# EAGLE design Arduino_S3v3_R2 (EAGLE 6.2)
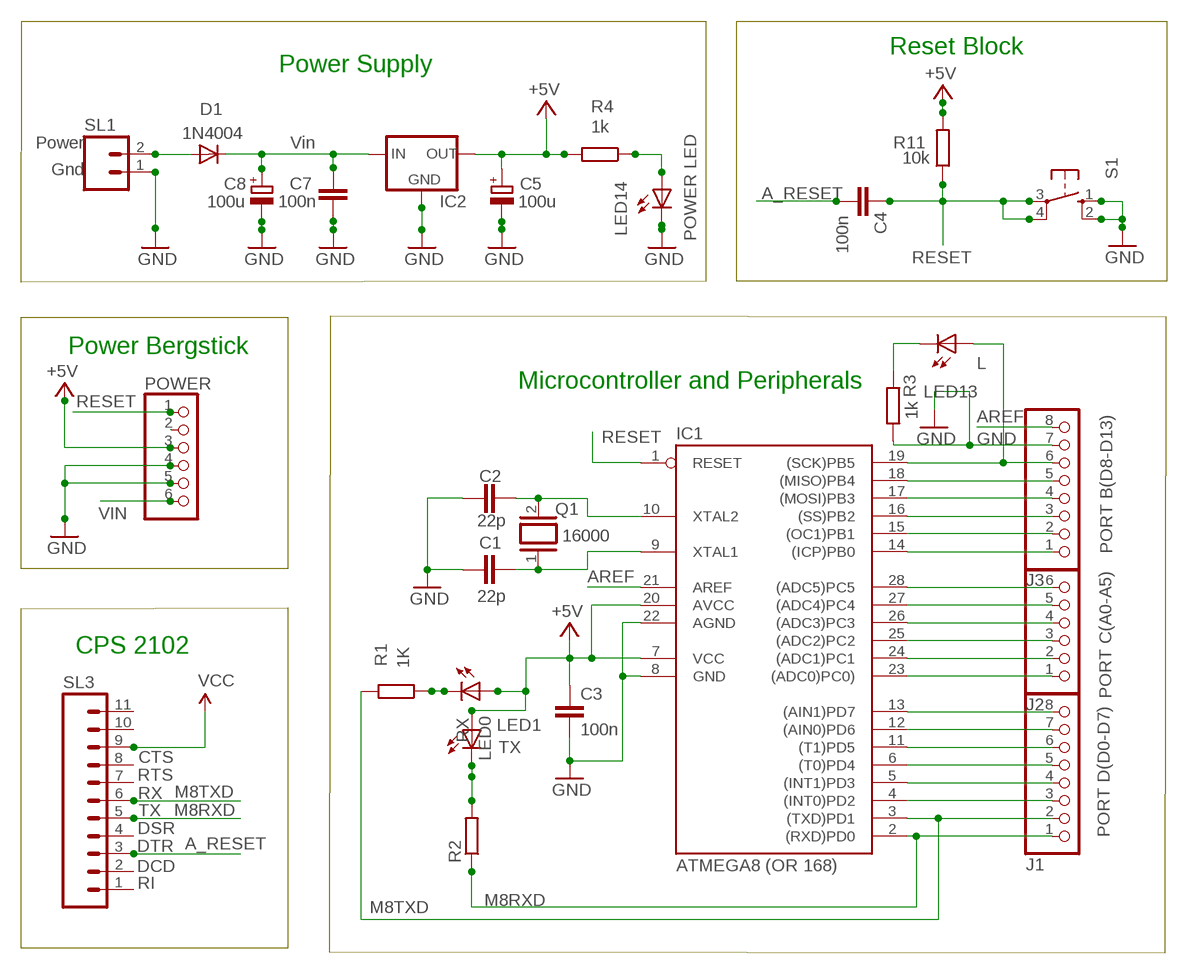
[diagram p0: schematic, sheet 1]

## Parts
C1  22p  C-EU050-025X075  [C050-025X075]
C2  22p  C-EU050-025X075  [C050-025X075]
C3  100n  C-EU050-025X075  [C050-025X075]
C4  100n  C-EU050-025X075  [C050-025X075]
C5  100u  CPOL-EUE3.5-8  [E3,5-8]
C7  100n  C-EU050-025X075  [C050-025X075]
C8  100u  CPOL-EUE3.5-8  [E3,5-8]
D1  1N4004  [DO41-10]
IC1  ATMEGA8 (OR 168)  AT90S4433P  [DIL28-3]
IC2  78XXL  [78XXL]
J1  PORT D(D0-D7)  PINHD-1X8  [1X08]
J2  PORT C(A0-A5)  PINHD-1X6  [1X06]
J3  PORT B(D8-D13)  PINHD-1X8  [1X08]
LED0  RX  LED3MM  [LED3MM]
LED1  TX  LED3MM  [LED3MM]
LED13  L  LED3MM  [LED3MM]
LED14  POWER LED  LED3MM  [LED3MM]
POWER  PINHD-1X6  [1X06]
Q1  16000  XTAL  [Q]
R1  1K  R-EU_0207/10  [0207/10]
R2  R-EU_0207/10  [0207/10]
R3  1k  R-EU_0207/10  [0207/10]
R4  1k  R-EU_0207/10  [0207/10]
R11  10k  R-EU_0207/10  [0207/10]
S1  10-XX  [B3F-10XX]
SL1  M02  [02P]
SL3  M11  [11P]

## Nets
3V3: POWER.2
+5V [power]: C3.1 C5.+ IC1.7(VCC) IC1.20(AVCC) IC2.OUT LED0.A LED1.A POWER.3 R4.2 R11.2
AREF: IC1.21(AREF) J3.8
AUTO_RESET: C4.2 SL3.3
GND: C1.1 C2.1 C3.2 C5.- C7.1 C8.- IC1.8(GND) IC1.22(AGND) IC2.GND J3.7 LED14.K(C) POWER.4 POWER.5 R3.1 S1.1(S) S1.2(S1) SL1.1
M8RXD: IC1.2((RXD)PD0) J1.1 R2.1 SL3.5
M8TXD: IC1.3((TXD)PD1) J1.2 R1.2 SL3.6
N$1: IC1.18((MISO)PB4) J3.5
N$2: LED0.K(C) R1.1
N$3: LED14.A R4.1
N$4: IC1.17((MOSI)PB3) J3.4
N$5: IC1.14((ICP)PB0) J3.1
N$6: C1.2 IC1.9(XTAL1) Q1.1
N$7: C2.2 IC1.10(XTAL2) Q1.2
N$9: LED1.K(C) R2.2
N$10: IC1.4((INT0)PD2) J1.3
N$11: IC1.5((INT1)PD3) J1.4
N$12: IC1.6((T0)PD4) J1.5
N$13: IC1.11((T1)PD5) J1.6
N$14: IC1.12((AIN0)PD6) J1.7
N$15: IC1.13((AIN1)PD7) J1.8
N$16: IC1.23((ADC0)PC0)) J2.1
N$17: IC1.24((ADC1)PC1) J2.2
N$18: IC1.25((ADC2)PC2) J2.3
N$19: IC1.26((ADC3)PC3) J2.4
N$20: IC1.27((ADC4)PC4) J2.5
N$21: IC1.28((ADC5)PC5) J2.6
N$22: IC1.15((OC1)PB1) J3.2
N$23: IC1.16((SS)PB2) J3.3
N$31: LED13.K(C) R3.2
POWER [power]: D1.A SL1.2
RESET: C4.1 IC1.1(RESET) POWER.1 R11.1 S1.3(P) S1.4(P1)
SCK: IC1.19((SCK)PB5) J3.6 LED13.A
VCC: SL3.9
VIN [power]: C7.2 C8.+ D1.C IC2.IN POWER.6
Unconnected: SL3.1 SL3.2 SL3.4 SL3.7 SL3.8 SL3.10 SL3.11

## Notes on the sheet
- Reset Block
- Power Supply
- Power | Vin
- Gnd
- A_RESET
- Power Bergstick
- Microcontroller and Peripherals
- CPS 2102
- CTS
- RTS
- RX
- TX
- DSR
- DTR | A_RESET
- DCD
- RI

## Library data of the parts
C1-C4 C7 = rcl:C-EU: CAPACITOR, European symbol
C5 C8 = rcl:CPOL-EU: POLARIZED CAPACITOR, European symbol
D1 = diode:1N4004: DIODE general purpose rectifier, 1 A
IC1 = atmel:AT90S4433: MICROCONTROLLER 4 Kbytes FLASH 128 bytes SRAM 256 bytes EEPROM UART 6-channel 10 bit ADC
IC2 = v-reg:78XXL: VOLTAGE REGULATOR
J1 J3 = pinhead:PINHD-1X8: PIN HEADER
J2 POWER = pinhead:PINHD-1X6: PIN HEADER
LED0 LED1 LED13 LED14 = led:LED: LED OSRAM: - CHIPLED LG R971, LG N971, LY N971, LG Q971, LY Q971, LO R971, LY R971 LH N974, LH R974 LS Q976, LO Q976, LY Q976 LO Q996 - Hyper CHIPLED LW Q18S LB Q993, LB Q99A, LB R99A - SideLED LS A670, LO A670, LY A670, LG A670, LP A670 LB A673, LV A673, LT A673, LW A673 LH A674 LY A675 LS A676, LA A676, LO A676, LY A676, LW A676 LS A679, LY A679, LG A679 - Hyper Micro SIDELED® LS Y876, LA Y876, LO Y876, LY Y876 LT Y87S - SmartLED LW L88C, LW L88S LB L89C, LB L89S, LG L890 LS L89K, LO L89K, LY L89K LS L896, LA L896, LO L896, LY L896 - TOPLED LS T670, LO T670, LY T670, LG T670, LP T670 LSG T670, LSP T670, LSY T670, LOP T670, LYG T670 LG T671, LOG T671, LSG T671 LB T673, LV T673, LT T673, LW T673 LH T674 LS T676, LA T676, LO T676, LY T676, LB T676, LH T676, LSB T676, LW T676 LB T67C, LV T67C, LT T67C, LS T67K, LO T67K, LY T67K, LW E67C LS E67B, LA E67B, LO E67B, LY E67B, LB E67C, LV E67C, LT E67C LW T67C LS T679, LY T679, LG T679 LS T770, LO T770, LY T770, LG T770, LP T770 LB T773, LV T773, LT T773, LW T773 LH T774 LS E675, LA E675, LY E675, LS T675 LS T776, LA T776, LO T776, LY T776, LB T776 LHGB T686 LT T68C, LB T68C - Hyper Mini TOPLED® LB M676 - Mini TOPLED Santana® LG M470 LS M47K, LO M47K, LY M47K Source: http://www.osram.convergy.de/
Q1 = special:XTAL: CRYSTAL
R1-R4 R11 = rcl:R-EU_: RESISTOR, European symbol
S1 = switch-omron:10-XX: OMRON SWITCH
SL1 = con-amp-quick:M02: AMP QUICK CONNECTOR; OC_FARNELL: unknown; OC_NEWARK: unknown
SL3 = con-amp-quick:M11: AMP QUICK CONNECTOR; OC_FARNELL: unknown; OC_NEWARK: unknown

## Net classes
1 power: width 0.61 mm

## Board
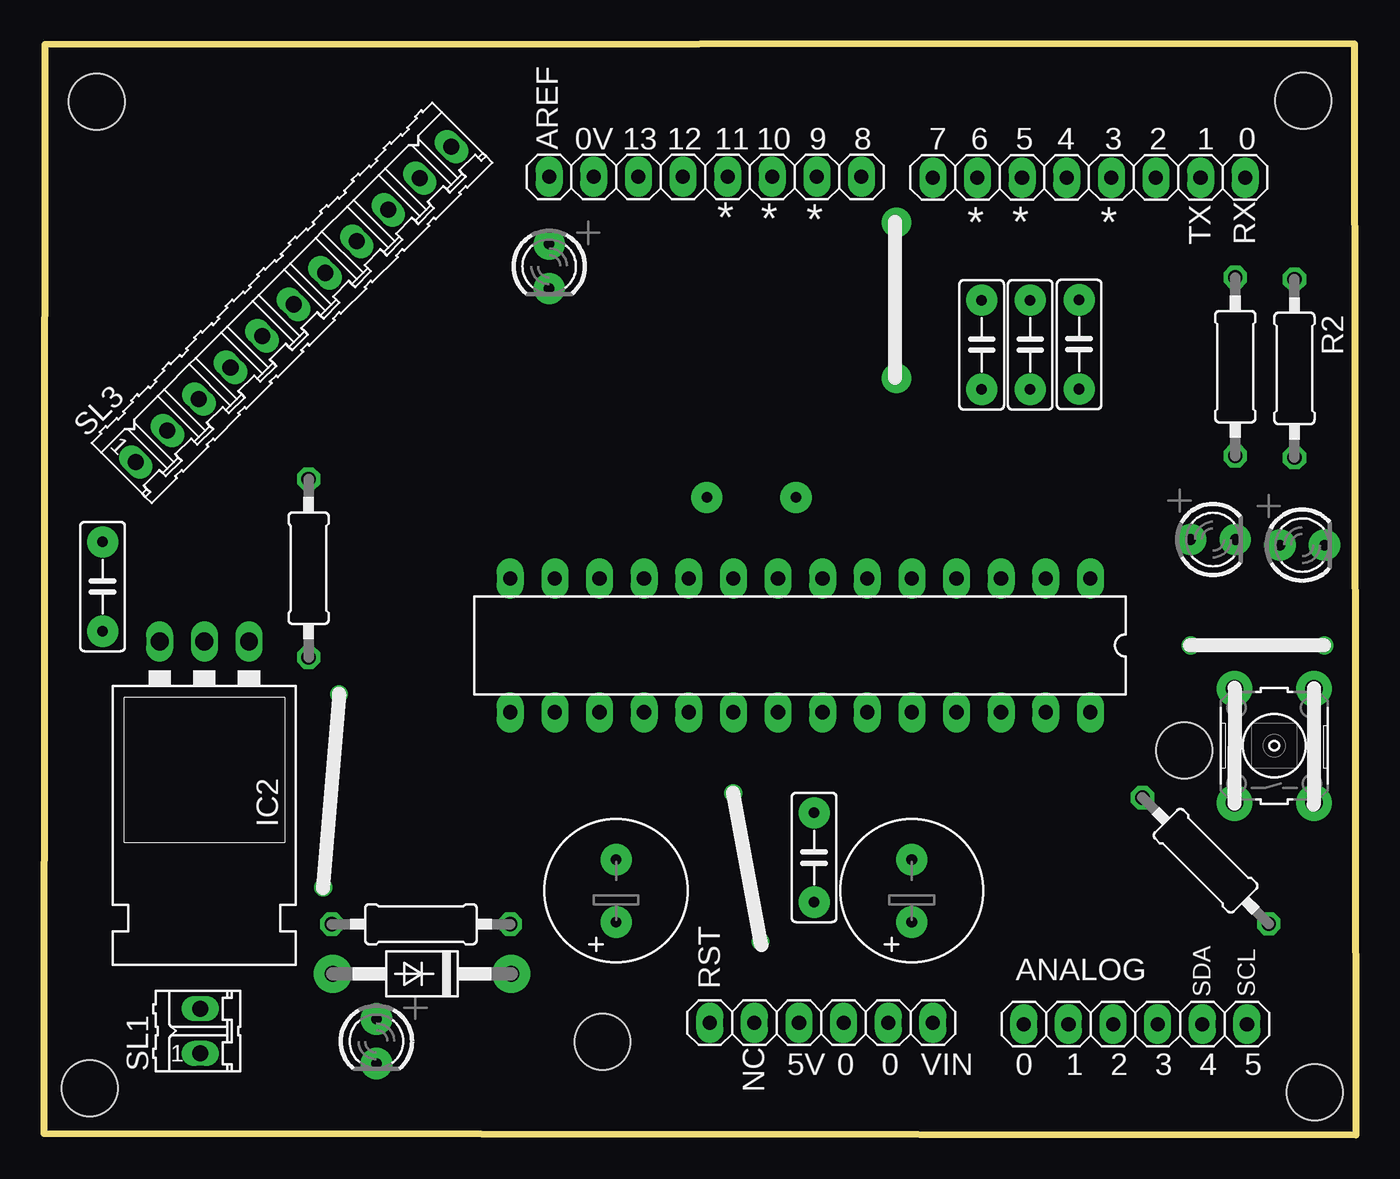
[diagram p1: board, top side]
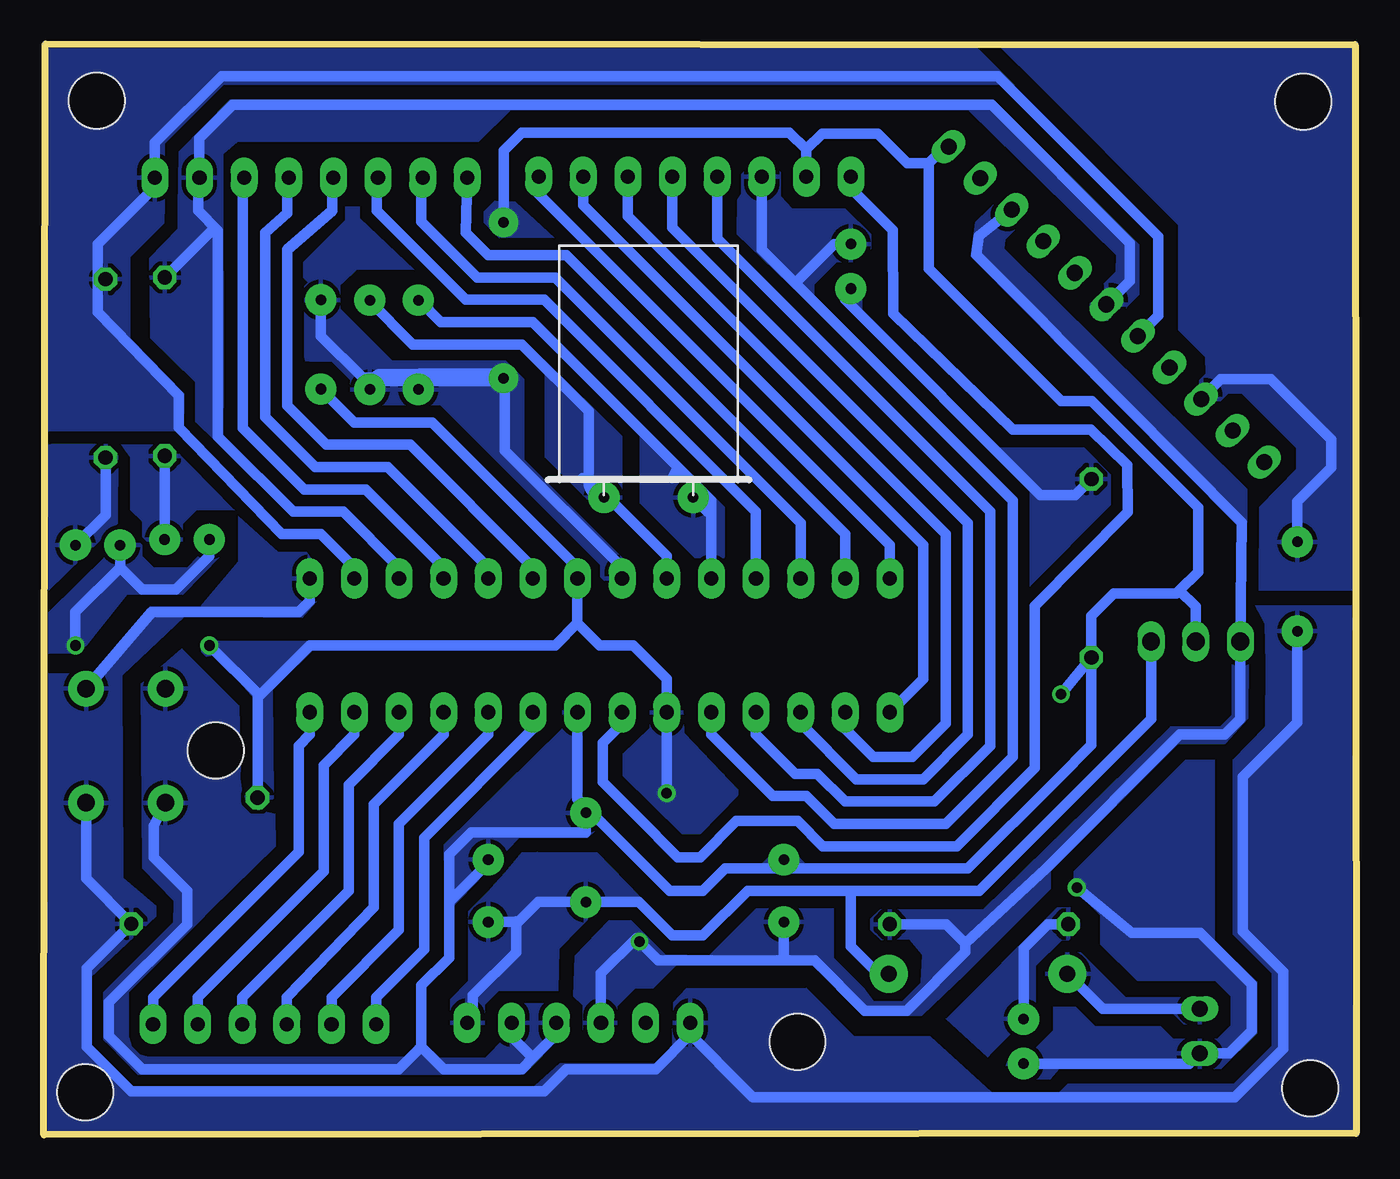
[diagram p2: board, bottom side, seen from below]

Size 74.69 x 62.12 mm. Coordinates in mm from the lower left corner, seen from the top.
Outline: 0.05,62.08 0,0.08 74.69,0 74.61,62.12 0.05,62.08
Copper layers (1*16): Top 0.035mm / dielectric 1.5mm / Bottom 0.035mm
Design rules: minimum track width 0.6mm, minimum drill 0.6mm, track to track 10mil, track to pad 0.67mm, pad to pad 0.67mm, via to via 0.67mm, smd to smd 0mil, copper to edge 0mil, drill to drill 8mil, minimum pad ring 10mil, minimum via ring 8mil, stop-mask expansion 0mil, vias tented up to drill 0mil, thermal gap 10mil
Holes 3.2 mm at 64.91,21.9 71.69,58.88 31.79,5.28 2.6,2.66 72.34,2.43 3.01,58.83

### Footprints (pad centres in the part's own frame; a part is rotated, then mirrored left to right if it is on the bottom)
C050-025X075 = drill 0.6 pad 1.778: 1 -2.54,0; 2 2.54,0
E3,5-8 = drill 0.6 pad 1.778: + -1.778,0; - 1.778,0
DO41-10 = drill 0.9 pad 2.159: A 5.08,0; C -5.08,0
DIL28-3 = drill 0.813 pad 1.524 long: 1 -16.51,-3.81; 2 -13.97,-3.81; 3 -11.43,-3.81; 4 -8.89,-3.81; 5 -6.35,-3.81; 6 -3.81,-3.81; 7 -1.27,-3.81; 8 1.27,-3.81; 9 3.81,-3.81; 10 6.35,-3.81; 11 8.89,-3.81; 12 11.43,-3.81; 13 13.97,-3.81; 14 16.51,-3.81; 15 16.51,3.81; 16 13.97,3.81; 17 11.43,3.81; 18 8.89,3.81; 19 6.35,3.81; 20 3.81,3.81; 21 1.27,3.81; 22 -1.27,3.81; 23 -3.81,3.81; 24 -6.35,3.81; 25 -8.89,3.81; 26 -11.43,3.81; 27 -13.97,3.81; 28 -16.51,3.81
78XXL = drill 1.016 long: GND 0,-3.81; IN -2.54,-3.81; OUT 2.54,-3.81
1X08 = drill 0.8 pad 1.524 long: 1 -8.89,0; 2 -6.35,0; 3 -3.81,0; 4 -1.27,0; 5 1.27,0; 6 3.81,0; 7 6.35,0; 8 8.89,0
1X06 = drill 0.8 pad 1.524 long: 1 -6.35,0; 2 -3.81,0; 3 -1.27,0; 4 1.27,0; 5 3.81,0; 6 6.35,0
LED3MM = drill 0.6 pad 1.778: A -1.27,0; K 1.27,0
Q = drill 0.6 pad 1.778: 1 -2.54,-7.62; 2 2.54,-7.62
0207/10 = drill 0.813 octagon: 1 -5.08,0; 2 5.08,0
B3F-10XX = drill 1 pad 2.032: 1 -3.251,2.261; 2 3.251,2.261; 3 -3.251,-2.261; 4 3.251,-2.261
02P = drill 0.914 long: 1 -1.27,0; 2 1.27,0
11P = drill 0.914 long: 1 -12.7,0; 2 -10.16,0; 3 -7.62,0; 4 -5.08,0; 5 -2.54,0; 6 0,0; 7 2.54,0; 8 5.08,0; 9 7.62,0; 10 10.16,0; 11 12.7,0

### Placement (x,y rotation side)
C1  56.14,44.99 90 top
C2  53.38,44.99 90 top
C3  58.93,45 90 top
C4  3.34,31.22 90 top
C5  32.57,13.89 90 top
C7  43.84,15.79 270 top
C8  49.4,13.9 90 top
D1  21.52,9.17 180 top
IC1  43.05,27.87 180 top
IC2  9.13,24.28 180 top
J1  59.49,54.51 180 top
J2  62.13,6.3 0 top
J3  37.64,54.55 180 top
LED0  66.54,33.9 0 top
LED1  71.62,33.58 0 top
LED13  28.76,49.46 270 top
LED14  18.92,5.32 270 top
POWER  44.25,6.38 0 top
Q1  40.28,43.91 0 bottom
R1  67.81,43.74 90 top
R2  71.18,43.64 270 top
R3  15.07,32.27 90 top
R4  21.46,11.99 0 top
R11  66.12,15.61 135 top
S1  70.03,22.16 90 top
SL1  8.9,5.91 90 top
SL3  14.21,47.29 45 top

### Tracks (layer width: path | path; a pad name or v marks a point on that pad's centre or on a via)
+5V  (via drill 0.6)
  Top 0.61: v65.27,27.87 v72.89,27.87 | v39.24,19.45 v40.8,11.01
  Bottom 0.6: POWER.3 42.98,9.2 40.99,11.2 | R4.2 | 30.83,9.93 | 25.59,7.07 27.97,7.07 30.83,9.93 | C3.1 58.92,42.63 C3.1 57.02,40.57 52.57,40.57 44.32,32.31 | 44.32,32.31 | 40.99,11.2 | 30.83,9.93 32.57,9.93 | 32.57,9.93 39.72,9.93 40.57,10.78 | v40.8,11.01 40.99,11.2 | C5.+ 32.57,9.93 | 44.32,32.31 IC1.7 | v39.24,19.45 39.24,20.88 | 39.24,20.88 IC1.20 | 39.24,20.88
  Bottom 0.61: IC1.20 39.24,25.96 41.14,27.87 43.05,27.87 44.32,29.14 | 44.32,29.14 IC1.7 | R11.2 62.53,24.89 62.42,25.01 | 62.42,25.01 59.56,27.87 45.59,27.87 44.32,29.14 | v65.27,27.87 62.42,25.01 | LED0.A 65.27,32.95 67.18,31.04 69.08,31.04 70.35,32.31 | 70.35,32.31 LED1.A | v72.89,27.87 72.89,29.77 70.35,32.31 | 20.31,52.11 21.48,51.16 21.61,50.12 18.12,46.62 16.61,45.06 6.5,34.86 IC2.OUT 6.59,23.68 7.49,22.79 10.03,22.79 17.65,15.17 22.24,10.89 | v40.8,11.01 40.57,10.78 | 22.24,10.89 22.24,10.42 25.59,7.07 | 22.24,10.89 23.34,11.99 R4.2
  pour Bottom: 74.46,27.41 72.89,27.4 72.26,27.87 71.75,28.52 69.94,30.76 66.79,30.73 64.62,32.95 64.64,34.22 65.27,34.85 65.91,34.22 65.91,32.95 66.54,32.31 68.45,32.31 69.08,32.95 69.08,33.58 69.72,34.22 70.35,34.22 70.99,33.58 71.07,33.06 74.45,29.74
  pour Bottom: 58.82,28.15 61.65,25.34 61.62,19.15 62.31,18.49 62.56,18.5 62.86,18.55 63.21,18.98 63.33,19.56 62.66,20.22 62.66,24.77 64.93,27.33 65.45,27.22 65.73,27.5 65.73,28.01 65.44,28.3 64.98,28.3 64.78,28.11 64.41,28.11
  pour Bottom: 6.2,34.86 6.83,34.76 21.94,50.01 21.68,51.97 20.07,53.54 19.42,53.64 18.64,52.84 18.74,52.21 19.96,50.99 20.02,50.48 6.2,36.77
  pour Bottom: 10.6,23.2 21.23,12.84 27.1,12.84 27.64,12.3 27.64,11.68 27.04,11.07 25.42,11.12 24.69,10.24 24.78,8.67 24.79,8.66 25.82,7.59 27.51,7.59 28.09,6.77 26.19,6.78 24.73,6.78 22.28,9.1 17.38,14 17.38,15 10,22.39 10,23.25 10.58,23.25
  pour Bottom: 6.19,29.05 5.88,28.76 5.85,27.46 6.12,27.11 6.13,23.72 7.45,22.26 10.09,22.27 10,23.25 7.72,23.25 7.07,23.9 7.08,27.18 7.3,27.42 7.3,28.75 6.98,29.07 6.2,29.07 6.17,29.03
  pour Bottom: 35.16,19.34 35.17,19.64 38.25,22.88 38.29,24.37 38.91,25 39.55,25 40.2,24.41 40.21,23.18 41.74,21.7 41.73,20.43 38.38,17.14 37.3,17.14 35.22,19.26
  pour Bottom: 27.93,8.26 27.47,7.6 28.13,6.93 30.96,9.65 36.83,9.74 36.83,10.22 34.15,12.9 29.74,12.9 29.74,10.09 27.97,8.31
  pour Bottom: 42.44,5.75 42.04,6.15 42.04,7.31 41.02,8.34 40.01,8.34 38.69,9.66 38.09,10.24 39.31,10.24 41.27,12.2 42.54,12.2 44.46,10.2 44.55,7.88 44.02,7.36 44.02,5.98 43.46,5.41 42.8,5.41 42.48,5.73 42.43,5.73
AREF
  Bottom 0.6: IC1.21 41.78,23.74 41.78,23.42 42.89,22.31 42.89,20.09 40.99,18.18 38.6,15.8 37.33,15.8 35.27,17.86 31.78,17.86 30.35,16.44 22.73,16.44 18.28,20.88 18.28,30.11 13.01,35.46 13.02,38.13 15.12,40.16 19.53,40.15 26.35,46.77 26.38,51.52 28.44,53.58 28.44,54.54 J3.8
AUTO_RESET
  Bottom 0.61: C4.2 3.34,36.07 1.42,37.99 1.42,39.6 4.85,43.03 7.69,43.03 SL3.3
  pour Bottom: 0.49,30.99 3.41,30.99 5.53,31 5.52,35.76 3.4,37.92 3.4,39.1 6.5,42.2 7.32,42.19 8.36,41.14 9.02,41.15 9.58,41.72 9.58,42.33 8.57,43.34 8.58,44.28 10.14,45.83 10.13,51.8 18.45,60.13 18.45,60.13 19.92,61.6 20.24,61.89 0.5,61.88 0.25,61.88 0.23,30.99
GND  (via drill 0.6, 0.6 pad 1.68)
  Top 0.6: 48.45,51.96 48.45,43.07 v48.53,43.07 | 48.45,51.96 48.45,52 | v48.53,51.96 48.45,51.96
  Top 0.61: S1.2 S1.1 | v15.89,14.09 v16.79,25.1
  Bottom 0.6: 41.78,32.31 | 41.78,32.31 48.45,38.98 48.45,43.11 48.49,43.11 v48.53,43.07 | 31.3,54.22 J3.7 | 17.01,20.25 22.09,15.17 32.57,15.17 | 43.84,17.23 50.35,17.23 51.62,15.96 51.62,13.26 | 51.62,13.26 51.62,10.09 53.21,8.5 53.21,5.01 51.94,3.74 47.49,3.74 46.86,4.37 | 46.86,4.37 48.13,5.64 48.13,6.28 48.06,6.28 POWER.5 | POWER.4 45.52,5.71 46.86,4.37 | 32.57,15.17 35.91,15.17 37.18,13.9 38.13,13.9 | C5.- 32.57,15.17 | 55.59,43.11 56.54,43.11 58.93,45.49 58.92,47.23 58.92,47.38 C3.2 | 38.13,13.89 39.07,13.89 43.68,18.5 | 43.68,18.5 44.16,18.98 44.16,18.97 44.19,18.97 43.84,17.71 43.84,17.23 | C7.1 43.84,18.03 43.84,17.23 | C8.- 49.4,15.48 51.62,13.26 | 43.68,18.5 | IC1.22 44.32,19.14 43.68,18.5 | 53.37,43.11 53.37,42.95 53.38,42.94 C2.1 | 41.78,32.31 IC1.8
  Bottom 0.61: 53.21,5.01 54.48,3.74 69.08,3.74 70.99,5.64 70.99,7.55 66.54,11.99 66.54,13.9 68.45,15.8 68.45,17.59 S1.1 | v48.53,51.96 48.53,56.04 47.49,57.08 32.25,57.08 31.29,56.12 | 17.01,20.25 15.07,22.19 R3.1 | IC2.GND 9.13,30.07 10.05,30.99 | R3.1 15.07,29.54 13.79,30.82 10.23,30.82 10.05,30.99 | 38.13,13.9 38.13,13.89 | v15.89,14.09 12.78,11.5 8.86,11.5 5.94,8.58 5.94,5.91 7.21,4.64 SL1.1 9.49,4.05 LED14.K | v16.79,25.1 R3.1 | 56.23,42.47 56.14,42.47 C1.1 | 31.29,56.12 30.39,57.02 27.22,57.02 25.54,55.34 24.32,55.34 | 24.32,55.34 23.11,56.55 | J3.7 31.29,56.12 | 10.05,30.99 9,32.05 9,35.71 15.06,41.78 16.77,41.78 24.33,49.33 24.33,55.33 24.32,55.34
  Bottom 1.016: 56.22,42.47 56.23,42.47 55.6,43.09 | 55.6,43.09 55.59,43.11 | 48.45,43.11 53.37,43.11 55.6,43.09
  pour Bottom (no thermals): 32.57,16.28 31.46,15.17 33.68,15.17
  pour Bottom: 63.56,24.43 66.84,27.7 69.17,25.66 69.08,15.17 67.3,13.33 67.33,11.99 66.78,12.19 66.44,11.57 61.5,16.42 61.51,18.28 63.29,18.69 63.5,20.31 63.5,20.99
  pour Bottom: 65.51,12.46 69.87,8.1 69.87,5.03 70.91,5.03 71.3,5.42 71.3,8.11 66.28,13.14 66.22,13.14 65.54,12.45
  pour Bottom: 69.85,5.52 70.96,5.08 69.34,3.43 47.55,3.43 47.36,3.44 45.24,5.57 45.22,7.49 48.45,7.52 48.42,5.54 49.57,4.38 52.18,4.4 52.95,5.16 53.53,5.12 54.08,4.44 68.74,4.45 69.24,4.57 69.69,5.03
  pour Bottom: 58.76,47.64 59.93,48.81 59.93,49.69 57.54,52.08 57.54,52.86 56.72,52.86 56.72,52.21 53.61,49.27 56.9,49.27 57.7,48.47 57.73,48.47 58.68,47.52
  pour Bottom: 41.72,31.14 41.2,31.66 41.2,32.32 47.34,38.46 47.34,43.03 48.4,44.08 54.85,44.08 57.81,47.04 57.81,48.4 58.27,48.86 59.32,48.86 59.86,48.32 59.87,44.3 59.81,44.05 59.55,44.04 58.31,44.04 57.25,42.98 57.25,41.99 56.81,41.55 52.12,41.55 43.03,32.46 43.03,31.76 42.4,31.13 41.73,31.13
  pour Bottom: 47.87,53.13 45.63,51.08 48.76,51.06 49.65,51.95 49.65,52.57 49.04,53.18
  pour Bottom: 19.29,3.14 19.96,3.86 19.57,4.91 18.52,4.96 18.19,4.97 17.24,5.96 17.24,7.23 17.24,7.29 17.18,7.29 15.95,7.29 14.84,6.18 11.12,6.18 10.4,5.46 7.91,5.46 7.13,6.24 7.13,7.88 8.02,8.76 12.46,8.76 14.55,10.85 14.55,12.5 16.08,14.02 16.08,15 9.72,21.36 8.05,21.36 8.05,11.06 5.64,8.71 5.64,5.79 7.68,3.75 16.89,3.75 17.41,3.16
  pour Bottom: 43.68,16.96 43.41,17.2 42.67,17.91 42.75,18 44.01,19.24 44.01,24.63 44.23,25.07 44.66,25.05 45.18,24.53 45.18,23.14 51.93,16.52 51.89,12.88 51.62,12.74 47.62,16.92 43.73,16.92
M8RXD
  Bottom 0.6: IC1.2 57.02,32.31 58.92,34.22 61.15,34.22 | J1.1 68.38,54.46 68.61,54.06
  Bottom 0.61: 68.61,54.06 68.61,53.74 71.62,50.73 71.62,46.85 67.03,42.1 67.03,40.26 61.15,34.22 | J1.1 68.38,56.49 64.57,60.29 20.4,60.29 11.26,51.15 11.26,47.17 11.26,46.85 11.26,46.65 SL3.5
  pour Bottom: 67.02,40.07 74.43,40.06 74.41,61.91 21.55,61.89 19.43,59.76 64.46,59.8 67.81,56.44 67.81,53.4 67.83,52.98 67.83,51.91 69.76,49.99 69.77,45.37 66.71,42.21 66.72,39.88 66.92,40.03 67.02,40.03
M8TXD
  Bottom 0.6: IC1.3 54.48,32.31 57.65,35.49 60.51,35.49 64.48,39.45 64.8,39.77 64.8,51.5 65.91,52.63 65.91,53.58 65.84,53.66 J1.2
  Bottom 0.61: 64.8,51.5 65.14,51.5 R1.2 | J1.2 65.84,56.76 63.94,58.65 20.74,58.65 12.87,50.78 12.87,48.63 SL3.6
  pour Bottom: 64.86,55.87 64.48,55.56 64.47,42.87 64.48,39.87 64.84,39.62 64.92,39.47 66.07,40.62 66.08,42.87 68.65,45.37 68.7,49.93 67.08,51.6 67.08,52.77 67.01,55.87
  pour Bottom: 14.55,46.38 14.49,46.32 13.74,46.43 12.34,47.85 12.33,50.68 20.61,58.96 64.08,58.96 67.02,55.99 67.05,53.01 66.95,52.9 64.47,52.9 64.48,55.83 63.69,56.52 49.93,56.55 48.12,58.34 22.07,58.33 13.65,50.1 13.67,49.15 15.08,47.73 15.19,47.08 14.88,46.62
N$1
  Bottom 0.6: J3.5 36.37,51.04 20.82,35.49 20.82,22.15 24,18.98 29.08,18.98 30.67,20.56 31.94,20.56 34.16,22.79 IC1.18
N$2
  Bottom 0.61: R1.1 LED0.K
  pour Bottom: 68.03,33.11 68.14,33.11 69.08,34.05 69.08,34.92 69.78,35.59 69.78,38.6 70.06,38.96 70.3,39.31 69.68,39.31 67.54,39.32 63.93,35.67 63.83,35.56 66,35.56 66.78,34.79 66.78,33.69 67.35,33.11 68.05,33.1
N$3
  Bottom 0.61: LED14.A 18.92,10.61 17.54,11.99 R4.1
  pour Bottom: 16.35,11.08 15.7,11.73 15.7,12.36 16.28,12.94 17,12.94 23.33,6.61 23.36,6.61 20.96,4.4 20.73,4.68 19.49,5.92 18.71,5.92 18.22,6.4 18.22,9.61 16.75,11.09 16.37,11.09
N$4
  Bottom 0.6: J3.4 38.91,51.67 22.09,34.85 22.09,22.79 24.63,20.25 28.44,20.25 31.62,23.42 IC1.17
N$5
  Bottom 0.6: IC1.14 26.54,33.58 46.54,53.58 46.54,54.22 J3.1
N$6
  Bottom 0.6: IC1.9 39.24,32.95 43.68,37.39 | 43.68,37.39 44.01,37.39 | 43.68,37.39 43.68,41.2 47.49,45.01 53.69,45.01 56.23,47.55 56.22,47.55 C1.2
  Bottom 0.61: 43.68,37.39 43.68,37.16 arc-90 Q1.1
  pour Bottom: 46.18,43.7 46.18,38.58 43.17,35.56 42.4,35.56 41.76,36.2 41.76,39.78 46.2,44.14
N$7
  Bottom 0.6: 38.6,38.03 46.86,46.28 52.1,46.28 53.37,47.55 53.38,47.55 C2.2 | IC1.10 36.7,35.49 36.7,36.12 38.6,38.03 | 38.6,38.03 38.93,37.39
  Bottom 0.61: Q1.2 36.93,35.49 36.7,35.49
  pour Bottom: 40.78,40.18 40.78,35.98 37.64,32.85 35.97,32.85 35.93,32.89 35.93,35.76 40.62,40.45 40.62,40.42 40.8,40.24
N$9
  Bottom 0.61: LED1.K 71.18,35.29 R2.2
  pour Bottom: 74.43,30.99 74.44,39.32 74.31,39.32 70.83,39.32 70.47,38.96 70.48,34.82
N$10
  Bottom 0.6: IC1.4 51.94,32.31 56.38,36.76 59.88,36.76 63.37,40.25 63.37,43.42 63.37,52.31 63.37,54.54 J1.3
N$11
  Bottom 0.6: IC1.5 49.4,32.31 55.11,38.03 59.24,38.03 62.1,40.88 62.1,51.36 60.83,52.47 60.83,54.54 J1.4
N$12
  Bottom 0.6: IC1.6 46.86,32.31 53.84,39.3 58.61,39.3 60.83,41.52 60.83,50.41 58.29,52.63 58.29,54.54 J1.5
N$13
  Bottom 0.6: IC1.11 34.16,35.49 46.22,47.55 50.67,47.55 55.75,52.63 55.75,54.51 | 55.75,54.51 55.75,54.54 | 55.75,54.51 J1.6
N$14
  Bottom 0.6: IC1.12 31.62,34.85 45.59,48.82 50.03,48.82 53.21,52 53.21,54.51 | 53.21,54.51 53.21,54.54 | 53.21,54.51 J1.7
N$15
  Bottom 0.6: IC1.13 29.08,34.22 44.95,50.09 49.4,50.09 50.67,51.36 J1.8
N$16
  Bottom 0.6: IC1.23 46.86,23.1 53.05,16.91 53.05,10.56 55.78,7.83 J2.1
N$17
  Bottom 0.6: IC1.24 49.4,22.78 54.48,17.71 54.48,11.67 58.32,7.83 J2.2
N$18
  Bottom 0.6: IC1.25 51.94,22.78 55.91,18.82 55.91,12.94 60.86,7.83 J2.3
N$19
  Bottom 0.6: IC1.26 54.48,22.78 57.34,19.93 57.34,13.9 63.4,7.83 J2.4
N$20
  Bottom 0.6: IC1.27 57.02,22.78 58.77,21.04 58.77,15.01 65.94,7.83 J2.5
N$21
  Bottom 0.6: IC1.28 59.56,22.78 60.19,22.15 60.19,16.12 68.48,7.83 J2.6
N$22
  Bottom 0.6: IC1.15 24.63,25.96 24.63,33.58 44,52.95 44,54.22 J3.2
N$23
  Bottom 0.6: IC1.16 29.08,23.1 27.49,21.52 25.27,21.52 23.36,23.42 23.36,34.22 41.46,52.31 41.46,54.22 | 41.46,54.22 41.46,54.54 | 41.46,54.22 J3.3
N$31
  Bottom 0.6: 17.97,36.44 29.08,47.55 29.08,48.19 LED13.K
  Bottom 0.61: 17.97,36.44 15.97,36.44 R3.2
  pour Bottom (no thermals): 28.13,48.19 28.13,46.6 29.08,47.55 29.08,48.19
  pour Bottom: 21.09,39.13 15.48,39.13 13.96,37.6 13.96,35.87 18.57,31.23 18.57,36.64 19.78,37.82
POWER
  Bottom 0.6: 16.38,9.13 16.38,9.17
  Bottom 0.61: 16.38,9.13 14.43,7.18 SL1.2
  Bottom 1.016: 16.38,9.17 D1.A
  pour Bottom: 8.16,7.3 8.69,7.82 13.12,7.82 15.68,10.38 16.99,10.38 17.69,9.67 17.69,8.89 17.02,8.22 15.79,8.22 14.45,6.88 10.41,6.88 9.82,6.29 8.6,6.29 8.05,6.84 8.05,7.25 8.07,7.25
RESET
  Top 0.61: S1.4 S1.3
  Bottom 0.61: 37.9,5.71 39.87,3.74 44.95,3.74 46.22,2.47 69.72,2.47 72.26,5.01 72.26,9.47 R11.1 72.29,14.59 S1.3 | 37.9,5.71 POWER.1 | IC1.1 59.56,30.4 60.19,29.77 68.57,29.77 S1.4 | C4.1 3.34,23.49 6.46,20.37 6.46,11.59 4.14,9.27 4.14,4.9 6.92,2.12 34.32,2.12 34.36,2.17 34.74,2.55 37.9,5.71
  pour Bottom: 0.23,28.7 0.2,0.29 74.48,0.21 74.45,26.31 71.94,26.27 68.63,30.1 65.8,30.09 63.64,32.66 63.62,35.24 61.36,33.2 59.73,33.19 59.11,32.3 59.03,30.55 60,29.44 66.66,29.5 70.22,26.16 70.16,14.62 68.31,13.05 68.31,12.45 72.48,8.53 72.39,8.36 72.49,8.48 72.49,5.07 69.78,2.52 47.04,2.52 45.33,4.07 39.44,4.07 38.94,4.56 38.86,7.55 38.13,8.34 31.3,8.37 28.57,5.6 24.25,5.6 20.44,2.13 17.19,2.13 16.41,2.91 6.96,2.91 4.8,5.07 4.8,9.21 7.01,11.42 7.01,21.34 5.17,23.25 5.14,26.81 5.19,29.13 5.76,30.17 4.27,30.15 0.24,30.15 0.23,28.75
SCK
  Bottom 0.6: IC1.19 36.7,22.79 33.21,19.29 31.3,19.29 29.71,17.71 23.36,17.71 19.55,21.52 19.55,36.12 31.94,48.5 | 31.94,48.5 33.84,50.41 33.84,54.54 J3.6 | LED13.A 29.71,50.73 31.94,48.5
  pour Bottom: 30.85,47.41 30.85,48.41 29.57,49.69 28.37,49.69 27.59,50.47 27.59,51.29 29.09,52.74 32.1,52.73 32.76,53.45 32.76,54.83 33.52,55.59 34.09,55.59 34.99,54.7 34.99,53.6 35.24,53.25 35.24,51.28 30.86,47.07
VIN
  Bottom 0.6: 47.81,12.12 47.69,12.12 46.54,13.26 C7.2 40.83,13.26 38.92,11.36 37.18,11.36 34.64,13.9 28.76,13.9 | POWER.6 50.6,6.66 50.27,6.99 50.28,7.93 47.81,10.4 47.81,12.12 | 47.81,12.12 47.81,12.15 | 13.52,21.83 13.83,21.53 21.46,13.9 28.76,13.9 | D1.C 27.21,9.17 28.76,10.72 28.76,13.9
  Bottom 0.61: IC2.IN 11.67,23.68 13.83,21.53 | 47.81,12.12 C8.+ | C7.2
  pour Bottom: 50.76,5.34 51.57,6.15 51.57,7.73 50.54,8.76 50.54,12.73 49.43,13.84 49.02,14.28 48.44,14.94 47.49,16.09 46.6,16.1 43.19,16.08 40.71,13.52 40.68,12.97 43.05,12.96 45.36,10.59 45.42,8.2 48.83,8.18 49.61,7.4 49.61,6.19 50.47,5.33 50.72,5.33

### Text on the board
tNames: AREF | 0V | 13 | 12 | 11 | 10 | 9 | 8 | 7 | 6 | 5 | 4 | 3 | 2 | 1 | 0 | * | * | * | * | * | * | TX | RX | RST | ANALOG | SDA | SCL | 5V | 0 | 0 | VIN | 0 | 1 | 2 | 3 | 4 | 5 | NC